# EAGLE design 2364Adapter_v1.1 (EAGLE 7.7.0)
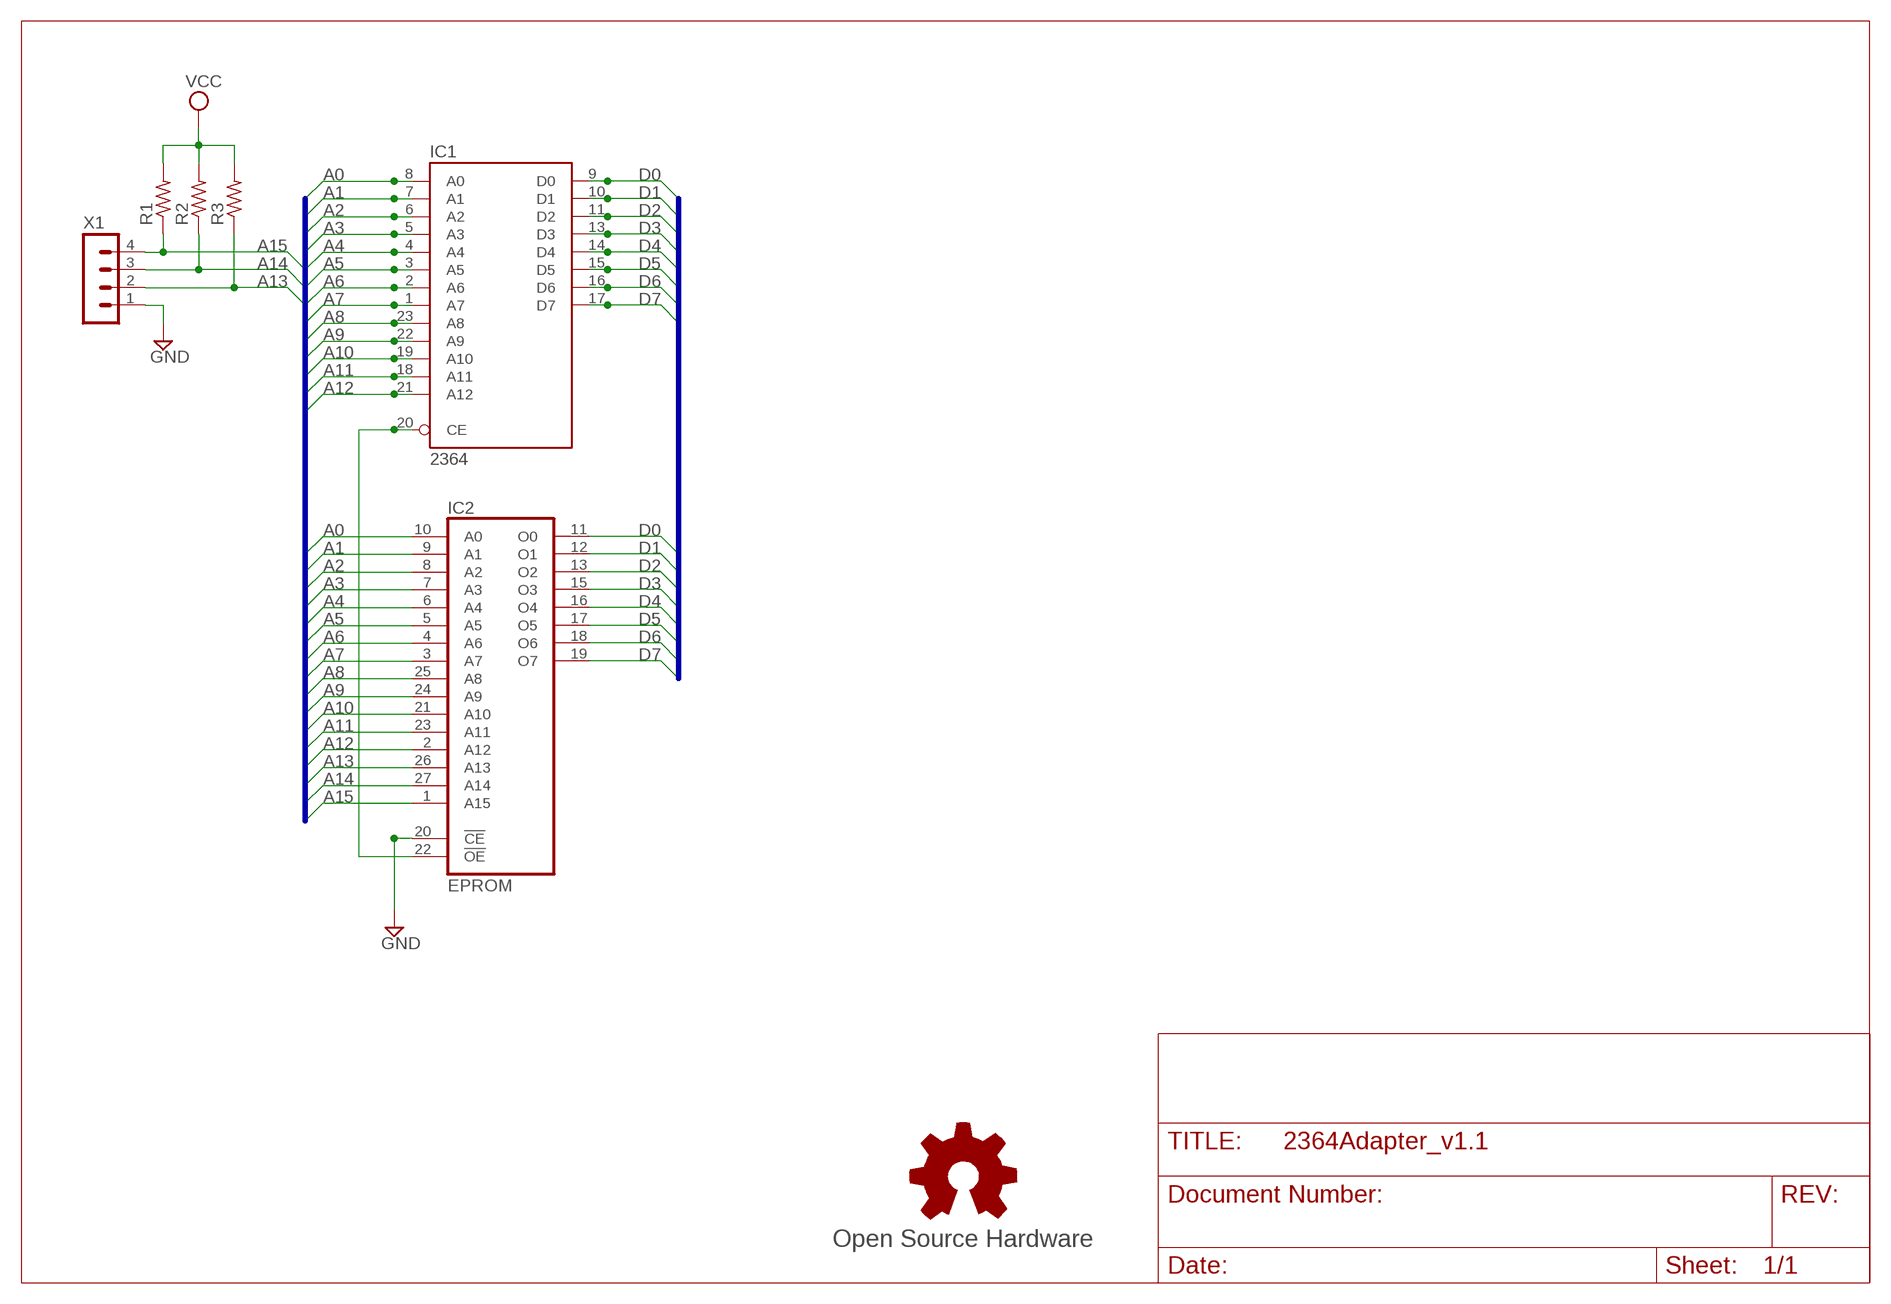
[diagram p0: schematic, sheet 1]

## Parts
GOLD_ORB_SM1  Open Source Hardware  OSHWLOGOLOGO5MM  [OSHW_5MM]
IC1  2364  2364-RP  [DIL24-ROUNDPAD]
IC2  EPROM  27512'RD'  [DIL28-ROUNDPAD]
R1  R-US_0204/5  [0204/5]
R2  R-US_0204/5  [0204/5]
R3  R-US_0204/5  [0204/5]
X1  MA04-1  [MA04-1]

## Nets
A0: IC1.8(A0) IC2.10(A0)
A1: IC1.7(A1) IC2.9(A1)
A2: IC1.6(A2) IC2.8(A2)
A3: IC1.5(A3) IC2.7(A3)
A4: IC1.4(A4) IC2.6(A4)
A5: IC1.3(A5) IC2.5(A5)
A6: IC1.2(A6) IC2.4(A6)
A7: IC1.1(A7) IC2.3(A7)
A8: IC1.23(A8) IC2.25(A8)
A9: IC1.22(A9) IC2.24(A9)
A10: IC1.19(A10) IC2.21(A10)
A11: IC1.18(A11) IC2.23(A11)
A12: IC1.21(A12) IC2.2(A12)
A13: IC2.26(A13) R1.1 X1.4
A14: IC2.27(A14) R2.1 X1.3
A15: IC2.1(A15) R3.1 X1.2
D0: IC1.9(D0) IC2.11(O0)
D1: IC1.10(D1) IC2.12(O1)
D2: IC1.11(D2) IC2.13(O2)
D3: IC1.13(D3) IC2.15(O3)
D4: IC1.14(D4) IC2.16(O4)
D5: IC1.15(D5) IC2.17(O5)
D6: IC1.16(D6) IC2.18(O6)
D7: IC1.17(D7) IC2.19(O7)
GND: IC2.20(!CE) X1.1
N$3: IC1.20(CE) IC2.22(!OE)
VCC: R1.2 R2.2 R3.2

## Buses
A[0..15]
D[0..7]

## Power pins joined to a net without a drawn wire
GND: IC1.12(GND) IC2.14(GND)
VCC: IC1.24(VCC) IC2.28(VCC)

## Library data of the parts
GOLD_ORB_SM1 = oshw:OSHWLOGO: The OSHW logo for PCB layout
IC1 = commodore:2364
IC2 = 0RB_Memory:27512
R1-R3 = resistor:R-US_: RESISTOR, American symbol
X1 = con-lstb-rp:MA04-1: PIN HEADER; OC_FARNELL: unknown; OC_NEWARK: unknown

## Board
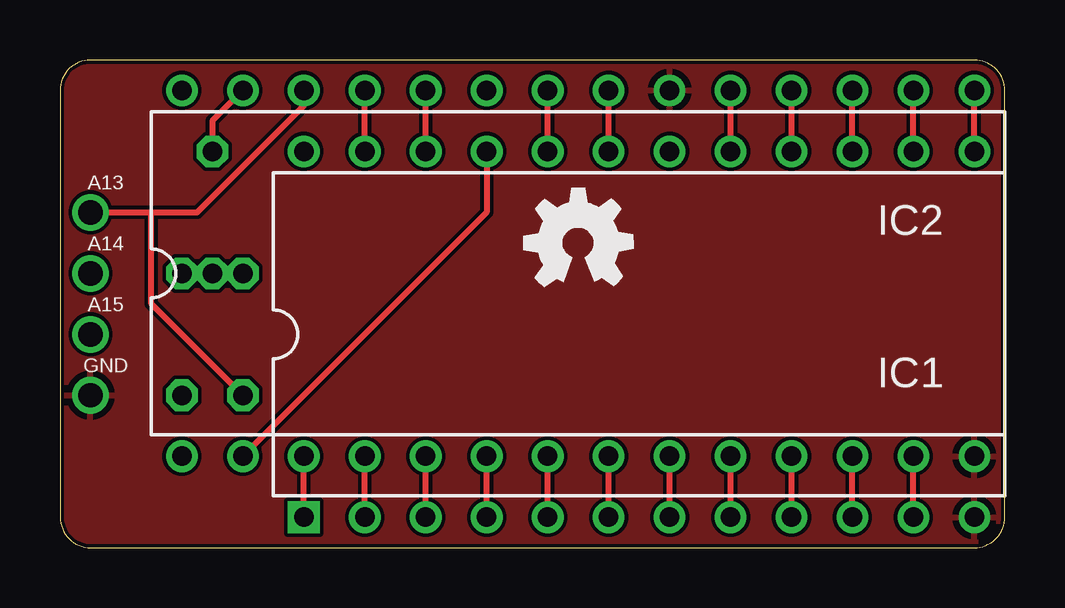
[diagram p1: board, top side]
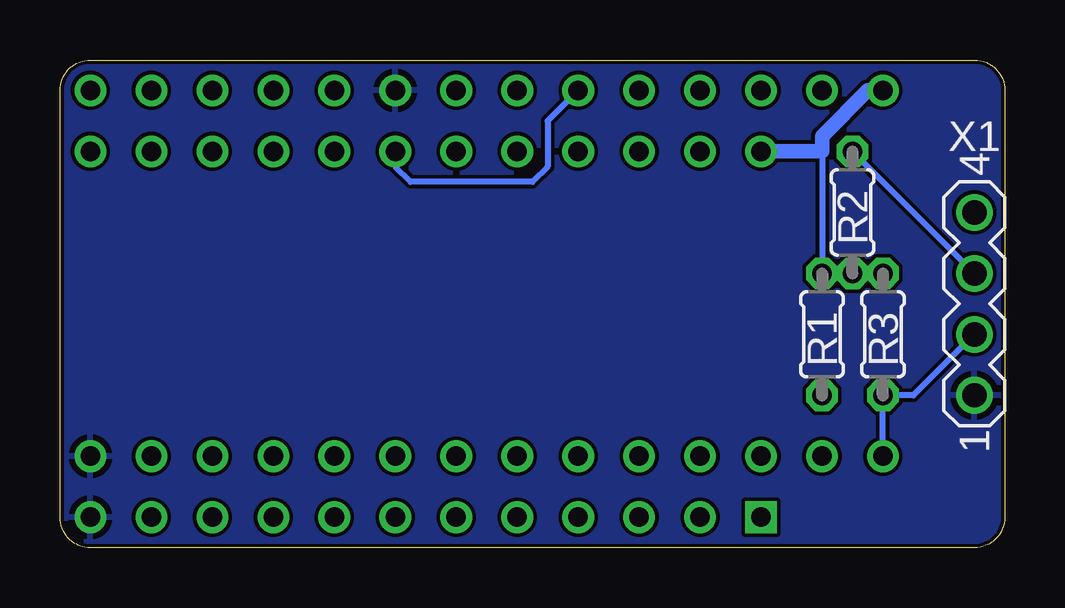
[diagram p2: board, bottom side, seen from below]

Size 39.37 x 20.32 mm. Coordinates in mm from the lower left corner, seen from the top.
Outline: 0,19.05 0.01,1.27 arc90 1.28,0 38.1,0 arc90 39.37,1.27 39.37,19.05 arc90 38.1,20.32 1.27,20.32 arc90 0,19.05
Copper layers (1*16): Top 0.035mm / dielectric 1.5mm / Bottom 0.035mm
Design rules "hackvana *": minimum track width 6mil, minimum drill 0.3mm, track to track 6mil, track to pad 6mil, pad to pad 6mil, via to via 6mil, smd to smd 0mil, copper to edge 6mil, drill to drill 6mil, minimum pad ring 10mil, minimum via ring 6mil, stop-mask expansion 2mil, vias tented up to drill 100mil, thermal gap 10mil

### Footprints (pad centres in the part's own frame; a part is rotated, then mirrored left to right if it is on the bottom)
DIL24-ROUNDPAD = drill 0.813 square: 1 -13.97,-7.62 | drill 0.813: 2 -11.43,-7.62; 3 -8.89,-7.62; 4 -6.35,-7.62; 5 -3.81,-7.62; 6 -1.27,-7.62; 7 1.27,-7.62; 8 3.81,-7.62; 9 6.35,-7.62; 10 8.89,-7.62; 11 11.43,-7.62; 12 13.97,-7.62; 13 13.97,7.62; 14 11.43,7.62; 15 8.89,7.62; 16 6.35,7.62; 17 3.81,7.62; 18 1.27,7.62; 19 -1.27,7.62; 20 -3.81,7.62; 21 -6.35,7.62; 22 -8.89,7.62; 23 -11.43,7.62; 24 -13.97,7.62
DIL28-ROUNDPAD = drill 0.813: 1 -16.51,-7.62; 2 -13.97,-7.62; 3 -11.43,-7.62; 4 -8.89,-7.62; 5 -6.35,-7.62; 6 -3.81,-7.62; 7 -1.27,-7.62; 8 1.27,-7.62; 9 3.81,-7.62; 10 6.35,-7.62; 11 8.89,-7.62; 12 11.43,-7.62; 13 13.97,-7.62; 14 16.51,-7.62; 15 16.51,7.62; 16 13.97,7.62; 17 11.43,7.62; 18 8.89,7.62; 19 6.35,7.62; 20 3.81,7.62; 21 1.27,7.62; 22 -1.27,7.62; 23 -3.81,7.62; 24 -6.35,7.62; 25 -8.89,7.62; 26 -11.43,7.62; 27 -13.97,7.62; 28 -16.51,7.62
0204/5 = drill 0.813 octagon: 1 -2.54,0; 2 2.54,0
MA04-1 = drill 1.016: 1 -3.81,0; 2 -1.27,0; 3 1.27,0; 4 3.81,0

### Placement (x,y rotation side)
GOLD_ORB_SM1  21.59,12.7 0 top
IC1  24.13,8.89 0 top
IC2  21.59,11.43 0 top
R1  7.62,8.89 90 bottom
R2  6.35,13.97 270 bottom
R3  5.08,8.89 90 bottom
X1  1.27,10.16 90 bottom

### Tracks (layer width: path | path; a pad name or v marks a point on that pad's centre or on a via)
A0
  Top 0.254: IC1.8 IC2.10
A1
  Top 0.254: IC1.7 IC2.9
A2
  Top 0.254: IC1.6 IC2.8
A3
  Top 0.254: IC1.5 IC2.7
A4
  Top 0.254: IC1.4 IC2.6
A5
  Top 0.254: IC1.3 IC2.5
A6
  Top 0.254: IC1.2 IC2.4
A7
  Top 0.254: IC1.1 IC2.3
A8
  Top 0.254: IC1.23 IC2.25
A9
  Top 0.254: IC1.22 IC2.24
A10
  Top 0.254: IC1.19 IC2.21
A11
  Bottom 0.254: IC1.18 25.4,15.88 24.76,15.24 19.68,15.24 19.05,15.88 19.05,17.78 IC2.23
A12
  Top 0.254: IC1.21 17.78,13.97 IC2.2
A13
  Top 0.254: X1.4 3.81,13.97 | 3.81,13.97 5.71,13.97 10.16,18.41 IC2.26 | R1.1 3.81,10.16 3.81,13.97
A14
  Top 0.254: R2.1 6.35,17.78 IC2.27
  Bottom 0.254: X1.3 R2.1
A15
  Bottom 0.254: IC2.1 R3.1 3.81,6.35 X1.2
D0
  Top 0.254: IC1.9 IC2.11
D1
  Top 0.254: IC1.10 IC2.12
D2
  Top 0.254: IC1.11 IC2.13
D3
  Top 0.254: IC1.13 IC2.15
D4
  Top 0.254: IC1.14 IC2.16
D5
  Top 0.254: IC1.15 IC2.17
D6
  Top 0.254: IC1.16 IC2.18
D7
  Top 0.254: IC1.17 IC2.19
GND
  pour Top: 38.1,0 1.27,0 arc-90 0,1.27 0,19.05 arc-90 1.27,20.32 38.1,20.32 arc-90 39.37,19.05 39.37,1.27 arc-90
  pour Bottom: 38.1,0 1.27,0 arc-90 0,1.27 0,19.05 arc-90 1.27,20.32 38.1,20.32 arc-90 39.37,19.05 39.37,1.27 arc-90
N$3
  Top 0.254: IC1.20 IC2.22
VCC
  Bottom 0.254: R2.2 R3.2 R1.2 7.62,16.51
  Bottom 0.61: IC2.28 5.71,19.05 7.62,17.14 7.62,16.51 IC1.24

### Text on the board
tNames: A13 | A14 | A15 | GND
tValues: (c) 2010 RETRO Innovations | www.go4retro.com